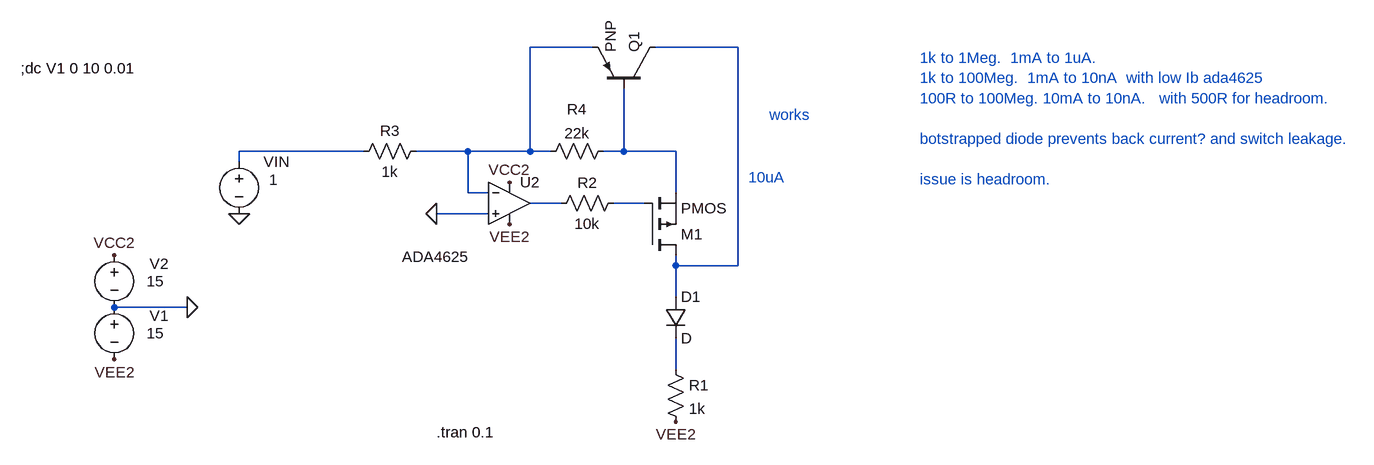
[diagram p0: schematic Draft14.asc]
Draft14.asc, the LTspice schematic file:
Version 4
SHEET 1 1768 680
WIRE 544 -144 448 -144
WIRE 768 -144 640 -144
WIRE 192 16 0 16
WIRE 352 16 272 16
WIRE 448 16 448 -144
WIRE 448 16 352 16
WIRE 480 16 448 16
WIRE 592 16 592 -80
WIRE 592 16 560 16
WIRE 672 16 592 16
WIRE 0 32 0 16
WIRE 352 80 352 16
WIRE 384 80 352 80
WIRE 672 80 672 16
WIRE 496 96 448 96
WIRE 624 96 576 96
WIRE 384 112 304 112
WIRE 672 192 672 176
WIRE 768 192 768 -144
WIRE 768 192 672 192
WIRE 672 240 672 192
WIRE -80 256 -192 256
WIRE 672 352 672 304
FLAG -80 256 0
FLAG -192 336 VEE2
FLAG -192 176 VCC2
FLAG 416 128 VEE2
FLAG 416 64 VCC2
FLAG 0 112 0
FLAG 304 112 0
FLAG 672 432 VEE2
SYMBOL voltage 0 16 R0
WINDOW 123 0 0 Left 0
WINDOW 39 0 0 Left 0
WINDOW 3 46 44 Left 2
WINDOW 0 38 16 Left 2
SYMATTR Value 1
SYMATTR InstName VIN
SYMBOL voltage -192 240 R0
WINDOW 0 54 29 Left 2
WINDOW 3 50 56 Left 2
WINDOW 123 0 0 Left 0
WINDOW 39 0 0 Left 0
SYMATTR InstName V1
SYMATTR Value 15
SYMBOL res 656 336 R0
SYMATTR InstName R1
SYMATTR Value 1k
SYMBOL res 288 0 R90
WINDOW 0 0 56 VBottom 2
WINDOW 3 32 56 VTop 2
SYMATTR InstName R3
SYMATTR Value 1k
SYMBOL pmos 624 176 M180
SYMATTR InstName M1
SYMBOL voltage -192 160 R0
WINDOW 0 54 29 Left 2
WINDOW 3 50 56 Left 2
WINDOW 123 0 0 Left 0
WINDOW 39 0 0 Left 0
SYMATTR InstName V2
SYMATTR Value 15
SYMBOL res 592 80 R90
WINDOW 0 0 56 VBottom 2
WINDOW 3 32 56 VTop 2
SYMATTR InstName R2
SYMATTR Value 10k
SYMBOL res 576 0 R90
WINDOW 0 -33 56 VBottom 2
WINDOW 3 -27 56 VTop 2
SYMATTR InstName R4
SYMATTR Value 22k
SYMBOL pnp 640 -80 M270
SYMATTR InstName Q1
SYMBOL OpAmps\\ADA4625 416 32 R0
WINDOW 3 -165 146 Left 2
SYMATTR InstName U2
SYMBOL diode 656 240 R0
SYMATTR InstName D1
TEXT -336 -112 Left 2 !;dc V1 0 10 0.01
TEXT 304 448 Left 2 !.tran 0.1
TEXT 816 -40 Left 2 ;works
TEXT 784 56 Left 2 ;10uA
TEXT 1048 -128 Left 2 ;1k to 1Meg.  1mA to 1uA.\n1k to 100Meg.  1mA to 10nA  with low Ib ada4625\n100R to 100Meg. 10mA to 10nA.   with 500R for headroom.\n \nbotstrapped diode prevents back current? and switch leakage.\n \nissue is headroom.

The netlist it stands for:
* Draft14.asc
VIN N003 0 1
V1 0 VEE2 15
R1 N007 VEE2 1k
R3 N001 N003 1k
M1 N002 N006 N004 N004 PMOS
V2 VCC2 0 15
R2 N006 N005 10k
R4 N004 N001 22k
Q1 N002 N004 N001 0 PNP
XU2 0 N001 VCC2 VEE2 N005 ADA4625  ; pins In+ In- V+ V- OUT
D1 N002 N007 D
.model D D
.lib standard.dio
.model NPN NPN
.model PNP PNP
.lib standard.bjt
.model NMOS NMOS
.model PMOS PMOS
.lib standard.mos
;dc V1 0 10 0.01
.tran 0.1
* works
* 10uA
* 1k to 1Meg.  1mA to 1uA.
* 1k to 100Meg.  1mA to 10nA  with low Ib ada4625
* 100R to 100Meg. 10mA to 10nA.   with 500R for headroom.
* botstrapped diode prevents back current? and switch leakage.
* issue is headroom.
.backanno
.end